# Altium project board_supply_440v.PrjPcb
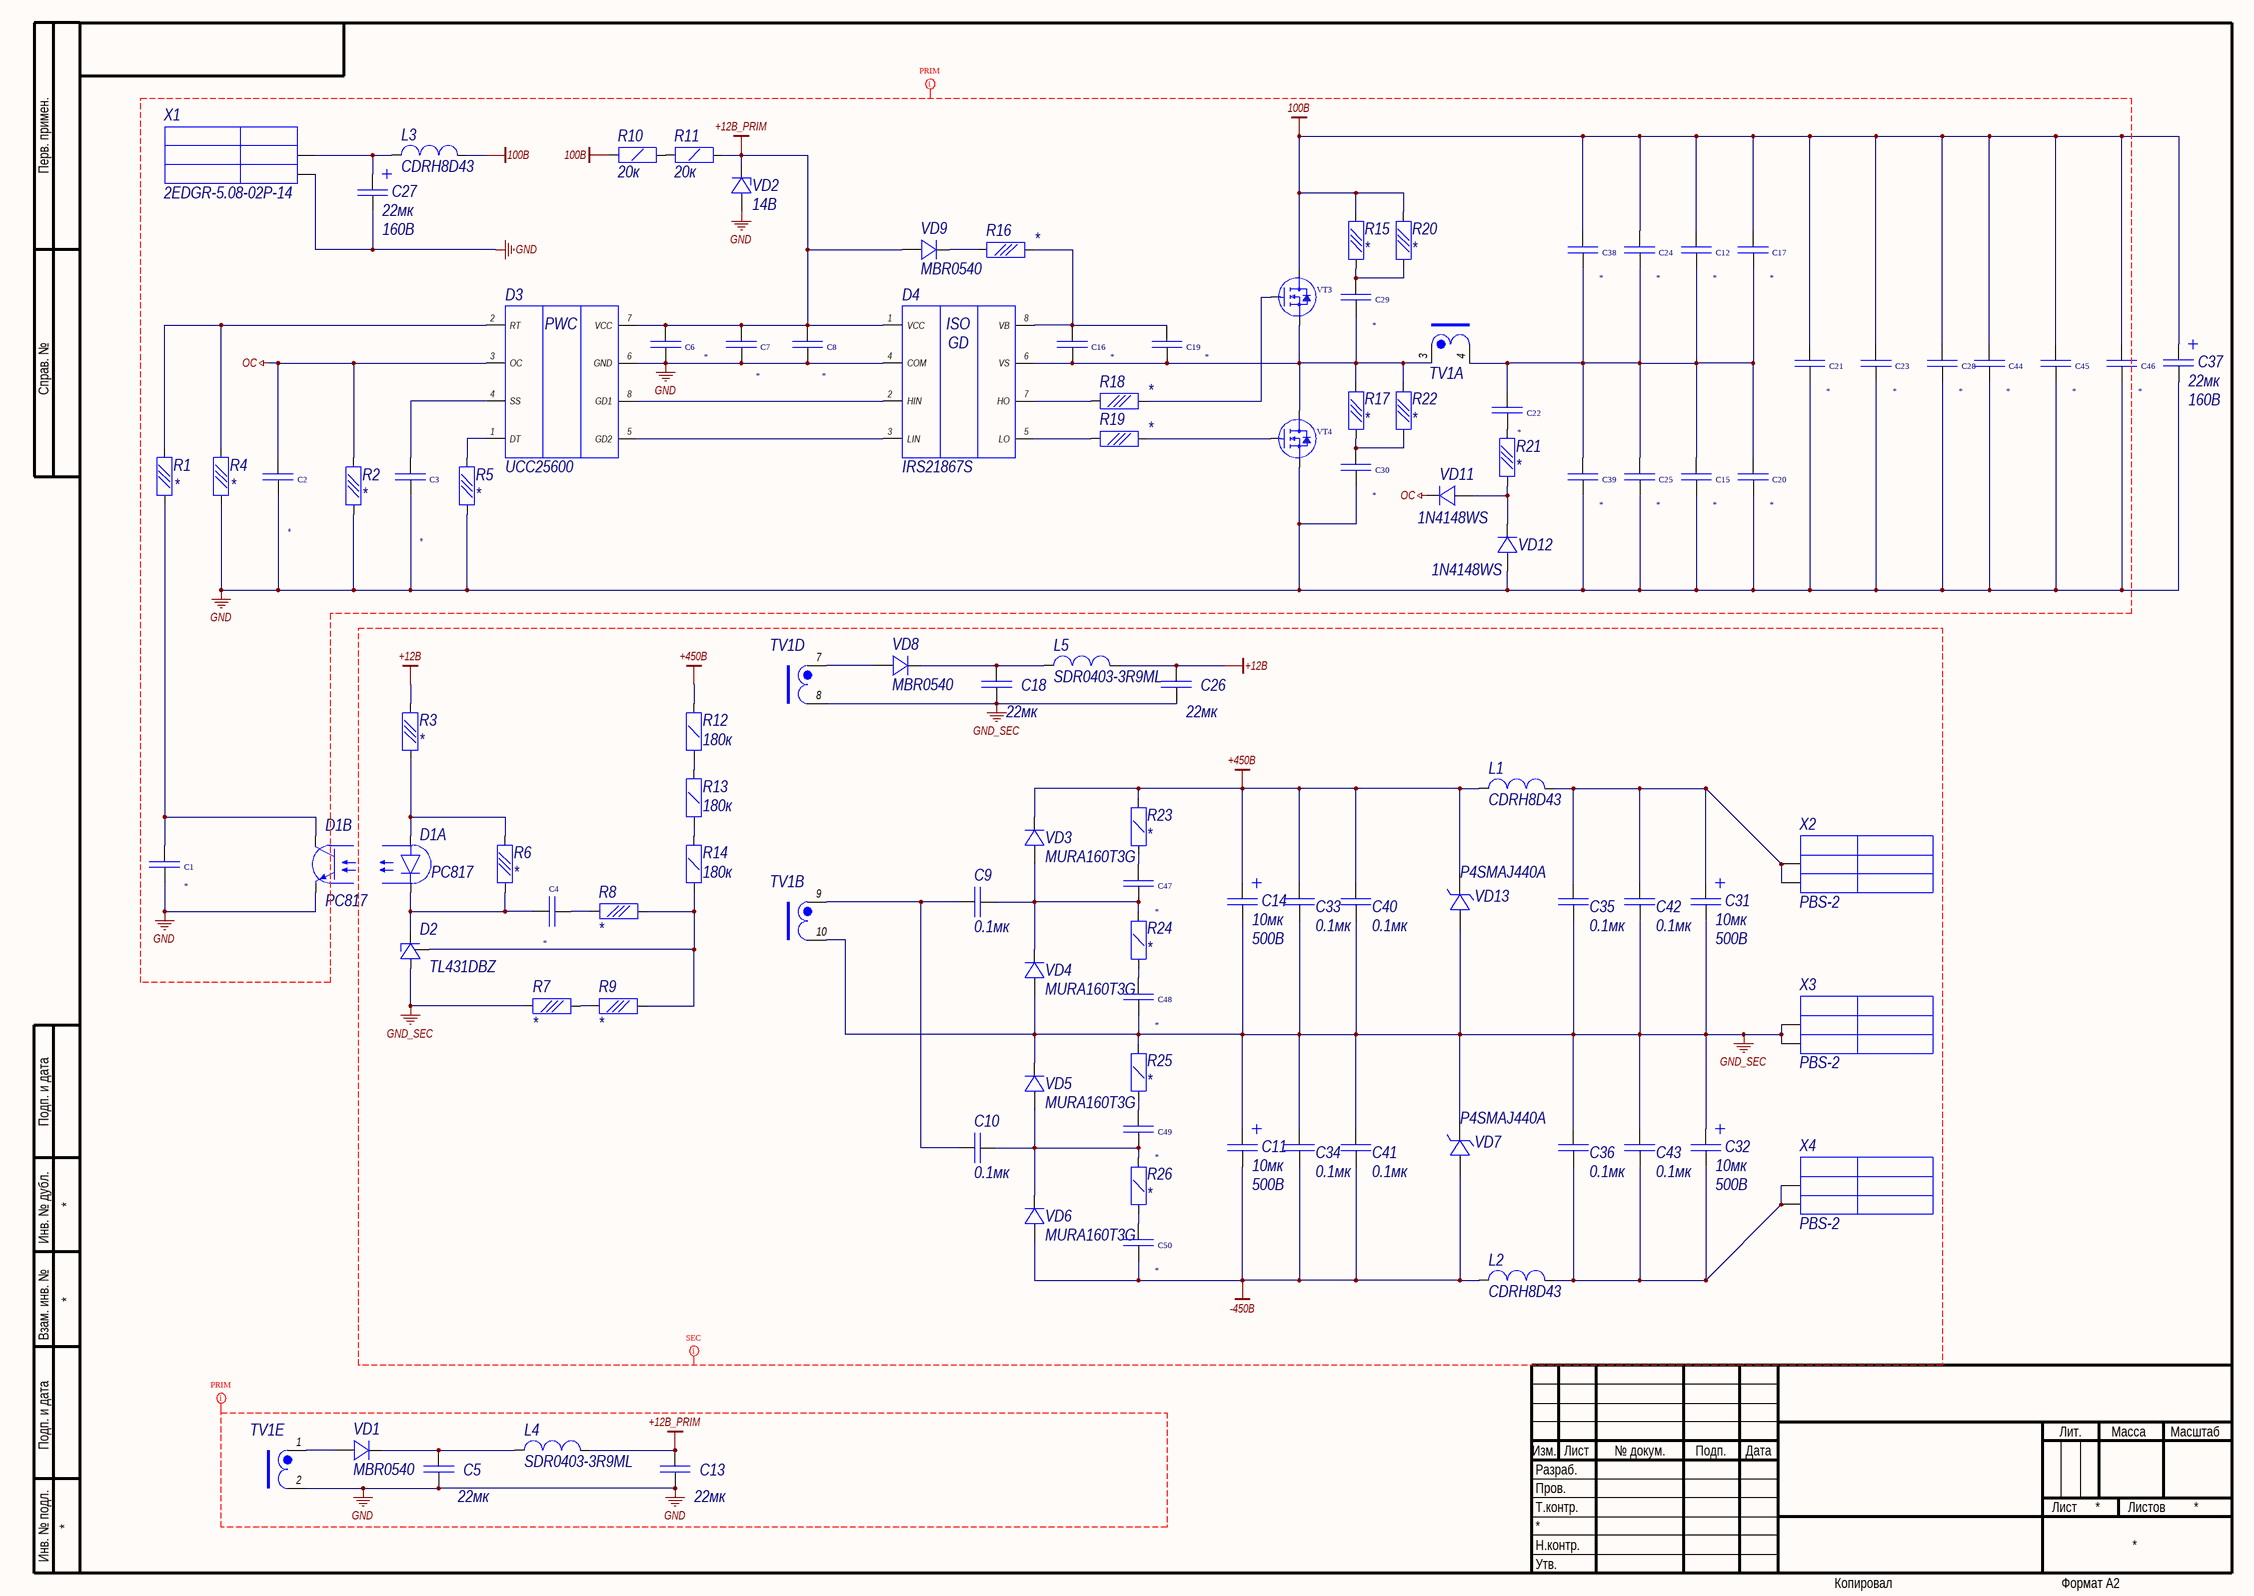
[diagram p0: board_supply_440v.SchDoc]
1 sheet, 104 parts. Net scope: global (net labels, ports and power ports of the same name join across sheets).
Board file: board_supply_440v.PcbDoc

## Sheet board_supply_440v.SchDoc
size 594 x 420 mm; Scale: 1:1

### Parts
C1  *  [C-0603]
C2  *  [C-0603]
C3  *  [C-0603]
C4  *  [C-0603]
C5  22мк  [C-1206]
C6  *  [C-0603]
C7  *  [C-0603]
C8  *  [C-0603]
C9  0.1мк  [C-1812]
C10  0.1мк  [C-1812]
C11  10мк  Voltage: 500В  [CAP: D13C5H25]
C12  *  [C-0603]
C13  22мк  [C-1206]
C14  10мк  Voltage: 500В  [CAP: D13C5H25]
C15  *  [C-0603]
C16  *  [C-0603]
C17  *  [C-0603]
C18  22мк  [C-1206]
C19  *  [C-0603]
C20  *  [C-0603]
C21  *  [C-0603]
C22  *  [C-0603]
C23  *  [C-0603]
C24  *  [C-0603]
C25  *  [C-0603]
C26  22мк  [C-1206]
C27  22мк  Voltage: 160В  [CAP: D10C5H16]
C28  *  [C-0603]
C29  *  [C-0603]
C30  *  [C-0603]
C31  10мк  Voltage: 500В  [CAP: D13C5H25]
C32  10мк  Voltage: 500В  [CAP: D13C5H25]
C33  0.1мк  [C-1812]
C34  0.1мк  [C-1812]
C35  0.1мк  [C-1812]
C36  0.1мк  [C-1812]
C37  22мк  Voltage: 160В  [CAP: D10C5H16]
C38  *  [C-0603]
C39  *  [C-0603]
C40  0.1мк  [C-1812]
C41  0.1мк  [C-1812]
C42  0.1мк  [C-1812]
C43  0.1мк  [C-1812]
C44  *  [C-0603]
C45  *  [C-0603]
C46  *  [C-0603]
C47  *  [C-1206]
C48  *  [C-1206]
C49  *  [C-1206]
C50  *  [C-1206]
D1  PC817  [DIP4-SMD]  (parts A,B of 2)
D2  TL431DBZ  [SOT-23-3]
D3  UCC25600  [8-SOIC]
D4  IRS21867S  [8-SOIC]
L1  CDRH8D43  [L-8.3x8.3x4.5]
L2  CDRH8D43  [L-8.3x8.3x4.5]
L3  CDRH8D43  [L-8.3x8.3x4.5]
L4  SDR0403-3R9ML  [L-4.5x4x3.2]
L5  SDR0403-3R9ML  [L-4.5x4x3.2]
R1  *  [R-0603]
R2  *  [R-0603]
R3  *  [R-0603]
R4  *  [R-0603]
R5  *  [R-0603]
R6  *  [R-0603]
R7  *  [R-0603]
R8  *  [R-0603]
R9  *  [R-0603]
R10  20к  [R-1206]
R11  20к  [R-1206]
R12  180к  [R-1206]
R13  180к  [R-1206]
R14  180к  [R-1206]
R15  *  [R-0603]
R16  *  [R-0603]
R17  *  [R-0603]
R18  *  [R-0603]
R19  *  [R-0603]
R20  *  [R-0603]
R21  *  [R-0603]
R22  *  [R-0603]
R23  *  [R-1206]
R24  *  [R-1206]
R25  *  [R-1206]
R26  *  [R-1206]
TV1  2xT26.9/14.7/11.2  [EE30]  (value not drawn)  (parts A,B,D,E of 5)
VD1  MBR0540  [SOD-123FL]
VD2  14В  [SOD-323]
VD3  MURA160T3G  [DO-214AC]
VD4  MURA160T3G  [DO-214AC]
VD5  MURA160T3G  [DO-214AC]
VD6  MURA160T3G  [DO-214AC]
VD7  P4SMAJ440A  [DO-214AC]
VD8  MBR0540  [SOD-123FL]
VD9  MBR0540  [SOD-123FL]
VD11  1N4148WS  [SOD-323]
VD12  1N4148WS  [SOD-323]
VD13  P4SMAJ440A  [DO-214AC]
VT3  __GENERIC-N  [WDFN-8]  (value not drawn)
VT4  __GENERIC-N  [WDFN-8]  (value not drawn)
X1  2EDGR-5.08-02P-14  [2EDGR-5.08-02P-14-00AH]
X2  PBS-2  [PBS-2]
X3  PBS-2  [PBS-2]
X4  PBS-2  [PBS-2]

### Nets
100В: C12.2 C17.2 C21.2 C23.2 C24.2 C28.2 C37.1 C38.2 C44.2 C45.2 C46.2 L3.1 R10.2 R15.1 R20.1 VT3.D
+12В: C26.1 L5.1 R3.2
+12В_PRIM: C6.2 C7.2 C8.2 C13.1 D3.7(VCC) D4.1(VCC) L4.1 R11.1 VD2.K VD9.A
+450В: C14.1 C33.1 C40.1 L1.2 R12.2 R23.1 VD3.K VD13.K
-450В: C11.2 C34.2 C41.2 C50.1 L2.2 VD6.A VD7.A
GND: C1.1 C2.1 C3.1 C5.2 C6.1 C7.1 C8.1 C13.2 C15.1 C20.1 C21.1 C23.1 C25.1 C27.2 C28.1 C30.1 C37.2 C39.1 C44.1 C45.1 C46.1 D1.3(E) D3.6(GND) D4.4(COM) R2.1 R4.1 R5.1 TV1.2 VD2.A VD12.A VT4.S X1.2
GND_SEC: C11.1 C14.2 C18.2 C26.2 C31.2 C32.1 C33.2 C34.1 C35.2 C36.1 C40.2 C41.1 C42.2 C43.1 C48.1 D2.3(A) R7.1 R25.1 TV1.8 TV1.10 VD4.A VD5.K VD7.K VD13.A X3.1 X3.2
OC: C2.2 D3.3(OC) R2.2 VD11.K
NetC1_2: C1.2 D1.4(C) R1.1
NetC3_2: C3.2 D3.4(SS)
NetC4_1: C4.1 R8.2
NetC4_2: C4.2 D1.2(K) D2.1(K) R6.1
NetC5_1: C5.1 L4.2 VD1.K
NetC9_1: C9.1 C47.1 R24.1 VD3.A VD4.K
NetC9_2: C9.2 C10.2 TV1.9
NetC10_1: C10.1 C49.1 R26.1 VD5.A VD6.K
NetC12_1: C12.1 C15.2 C17.1 C20.2 C22.1 C24.1 C25.2 C38.1 C39.2 TV1.4
NetC16_1: C16.1 C19.1 C29.1 D4.6(VS) R17.1 R22.1 TV1.3 VT3.S VT4.D
NetC16_2: C16.2 C19.2 D4.8(VB) R16.2
NetC18_1: C18.1 L5.2 VD8.K
NetC22_2: C22.2 R21.2
NetC27_1: C27.1 L3.2 X1.1
NetC29_2: C29.2 R15.2 R20.2
NetC30_2: C30.2 R17.2 R22.2
NetC31_1: C31.1 C35.1 C42.1 L1.1 X2.1 X2.2
NetC32_2: C32.2 C36.2 C43.2 L2.1 X4.1 X4.2
NetC47_2: C47.2 R23.2
NetC48_2: C48.2 R24.2
NetC49_2: C49.2 R25.2
NetC50_2: C50.2 R26.2
NetD1_1: D1.1(A) R3.1 R6.2
NetD2_2: D2.2(R) R8.1 R9.2 R14.1
NetD3_1: D3.1(DT) R5.2
NetD3_2: D3.2(RT) R1.2 R4.2
NetD3_5: D3.5(GD2) D4.3(LIN)
NetD3_8: D3.8(GD1) D4.2(HIN)
NetD4_5: D4.5(LO) R19.1
NetD4_7: D4.7(HO) R18.1
NetR7_2: R7.2 R9.1
NetR10_1: R10.1 R11.2
NetR12_1: R12.1 R13.2
NetR13_1: R13.1 R14.2
NetR16_1: R16.1 VD9.K
NetR18_2: R18.2 VT3.G
NetR19_2: R19.2 VT4.G
NetR21_1: R21.1 VD11.A VD12.K
NetTV1_1: TV1.1 VD1.A
NetTV1_7: TV1.7 VD8.A

### Layout directives
net class PRIM: 100В, +12В_PRIM, GND, OC
net class SEC: +12В, +450В, -450В, GND_SEC

### Notes on the sheet
- Перв. примен.
- Справ. №
- Подп. и дата
- Инв. № дубл.
- Взам. инв. №
- Разраб.
- Изм.
- Лист
- № докум.
- Подп.
- Дата
- Лит.
- Масса
- Масштаб
- Пров.
- Т.контр.
- Листов
- Инв. № подл.
- Утв.
- Н.контр.
- Копировал
- Формат А2
- (in symbol IRS21867S) ISO; GD
- (in symbol UCC25600) PWC

### Library data of the parts
C1-C4 C6-C8 C12 C15-C17 C19-C25 C28-C30 C38 C39 C44-C46 = C0603: Voltage: *; ComponentDescription: =ComponentType+', '+Package+', '+Voltage+'В, '+Value+', '+Dielectric; ComponentType: Конденсатор керамический SMD; Dielectric: *; Package: C-0603; Value: *
C5 C13 C18 C26 = C1206: Voltage: 25; Dielectric: X7R; ComponentDescription: =ComponentType+', '+Package+', '+Voltage+'В, '+Value+', '+Dielectric; ComponentType: Конденсатор керамический SMD; Package: C-1206; Value: 22мк
C9 C10 C33-C36 C40-C43 = C1812: Voltage: 630; Dielectric: X7R; ComponentDescription: =ComponentType+', '+Package+', '+Voltage+'В, '+Value+', '+Dielectric; ComponentType: Конденсатор керамический SMD; Package: C-1812; Value: 0.1мк
C11 C14 C27 C31 C32 C37 = Aluminum electrolytic capacitor: Конденсатор электролитический; Type: ESR; ComponentDescription: =ComponentType+', '+Value+', '+Voltage+', '+Type+', '+Package; ComponentType: Конденсатор электролитический
  C11 C14 C31 C32: Package: CAP: D13C5H25; Value: 10мк
  C27 C37: Package: CAP: D10C5H16; Value: 22мк
C47-C50 = C1206: Voltage: *; ComponentDescription: =ComponentType+', '+Package+', '+Voltage+'В, '+Value+', '+Dielectric; ComponentType: Конденсатор керамический SMD; Dielectric: *; Package: C-1206; Value: *
D1 = PC817: Оптрон с транзисторным выходом; ComponentDescription: =ComponentType+', '+Comment+', '+Package; Package: DIP4-SMD; ComponentType: Оптрон с транзисторным выходом
D2 = TL431DBZ: Микросхема ИОН; ComponentDescription: =ComponentType+', '+Comment+', '+Package; Package: SOT-23-3; ComponentType: Микросхема ИОН
D3 = UCC25600: Микросхема контроллер LLC; ComponentTypе: Микросхема контроллер PWM; ComponentDescription: =ComponentTypе+', '+Comment+', '+Package; Package: 8-SOIC
D4 = IRS21867S: Микросхема полумостовой драйвер; ComponentTypе: Микросхема контроллер PWM; ComponentDescription: =ComponentTypе+', '+Comment+', '+Package; Package: 8-SOIC
L1-L3 = CDRH8D43: SMD дроссель; ComponentDescription: =ComponentTypе+', '+Comment+', '+Package; ComponentTypе: SMD дроссель; Package: L-8.3x8.3x4.5
L4 L5 = SDR0403-3R9ML: ComponentTypе: ЭМИ фильтр индуктивный; ComponentDescription: =ComponentTypе+', '+Comment+', '+Package; Package: L-4.5x4x3.2
R1-R9 R15-R22 = R0603: Резистор SMD; Tolerance: 5%; ComponentDescription: =ComponentType+', '+ Package +', '+Value+'Ом, ' + Tolerance; ComponentType: Резистор SMD; Package: R-0603; Value: *
R10-R14 R23-R26 = R1206: Резистор SMD; Tolerance: 5%; ComponentDescription: =ComponentType+', '+ Package +', '+Value+'Ом, ' + Tolerance; ComponentType: Резистор SMD; Package: R-1206
  R10 R11: Value: 20к
  R12-R14: Value: 180к
  R23-R26: Value: *
TV1 = 2xT26.9/14.7/11.2: Трансформатор для board_supply_440v; ComponentDescription: 2xT26.9/14.7/11.2
VD1 VD8 VD9 = MBR0540: Диод выпрямительный одиночный; pin to pad: A>1 K>2; ComponentDescription: =ComponentType+', '+Comment+', '+Package; =ComponentType: Диод выпрямительный одиночный; Package: SOD-123FL
VD2 = MM3Z: Диод Зенера (стабилитрон); pin to pad: A>1 K>2; ComponentDescription: =ComponentType+', '+ComponentName+' '+Comment+', '+Package; ComponentType: Диод Зенера (стабилитрон); Package: SOD-323; ComponentName: MM3Z
VD3-VD6 = MURA160T3G: Диод выпрямительный одиночный; pin to pad: A>1 K>2; ComponentDescription: =ComponentType+', '+Comment+', '+Package; ComponentType: Диод выпрямительный одиночный; Package: DO-214AC
VD7 VD13 = P4SMAJ-XX-A: Защитный диод униполярный; pin to pad: A>1 K>2; ComponentDescription: =ComponentType+', '+Comment+', '+Package; ComponentType: Защитный диод униполярный; Package: DO-214AC
VD11 VD12 = 1N4148WS: Диод выпрямительный одиночный; pin to pad: A>1 K>2; ComponentDescription: =ComponentType+', '+Comment+', '+Package; ComponentType: Диод выпрямительный одиночный; Package: SOD-323
VT3 VT4 = __GENERIC-N: Транзистор МОП, одиночный, N-канальный; ComponentDescription: =ComponentType+', '+ChannelType+', '+Comment+', '+Package; ChannelType: N-канальный; ComponentType: Транзистор МОП, одиночный; Package: WDFN-8
X1 = 2EDGR-5.08-02P-14-00AH: Разъем разрывной; ComponentDescription: Разъём, 2EDGR-5.08-02P-14; ComponentTypе: Разъём
X2-X4 = PBS-2: Разъём штыревой; ComponentDescription: Разъём штыревой, PBS-2; ComponentTypе: Разъём штыревой